# EAGLE design humidity_brick (EAGLE 7.2.0)
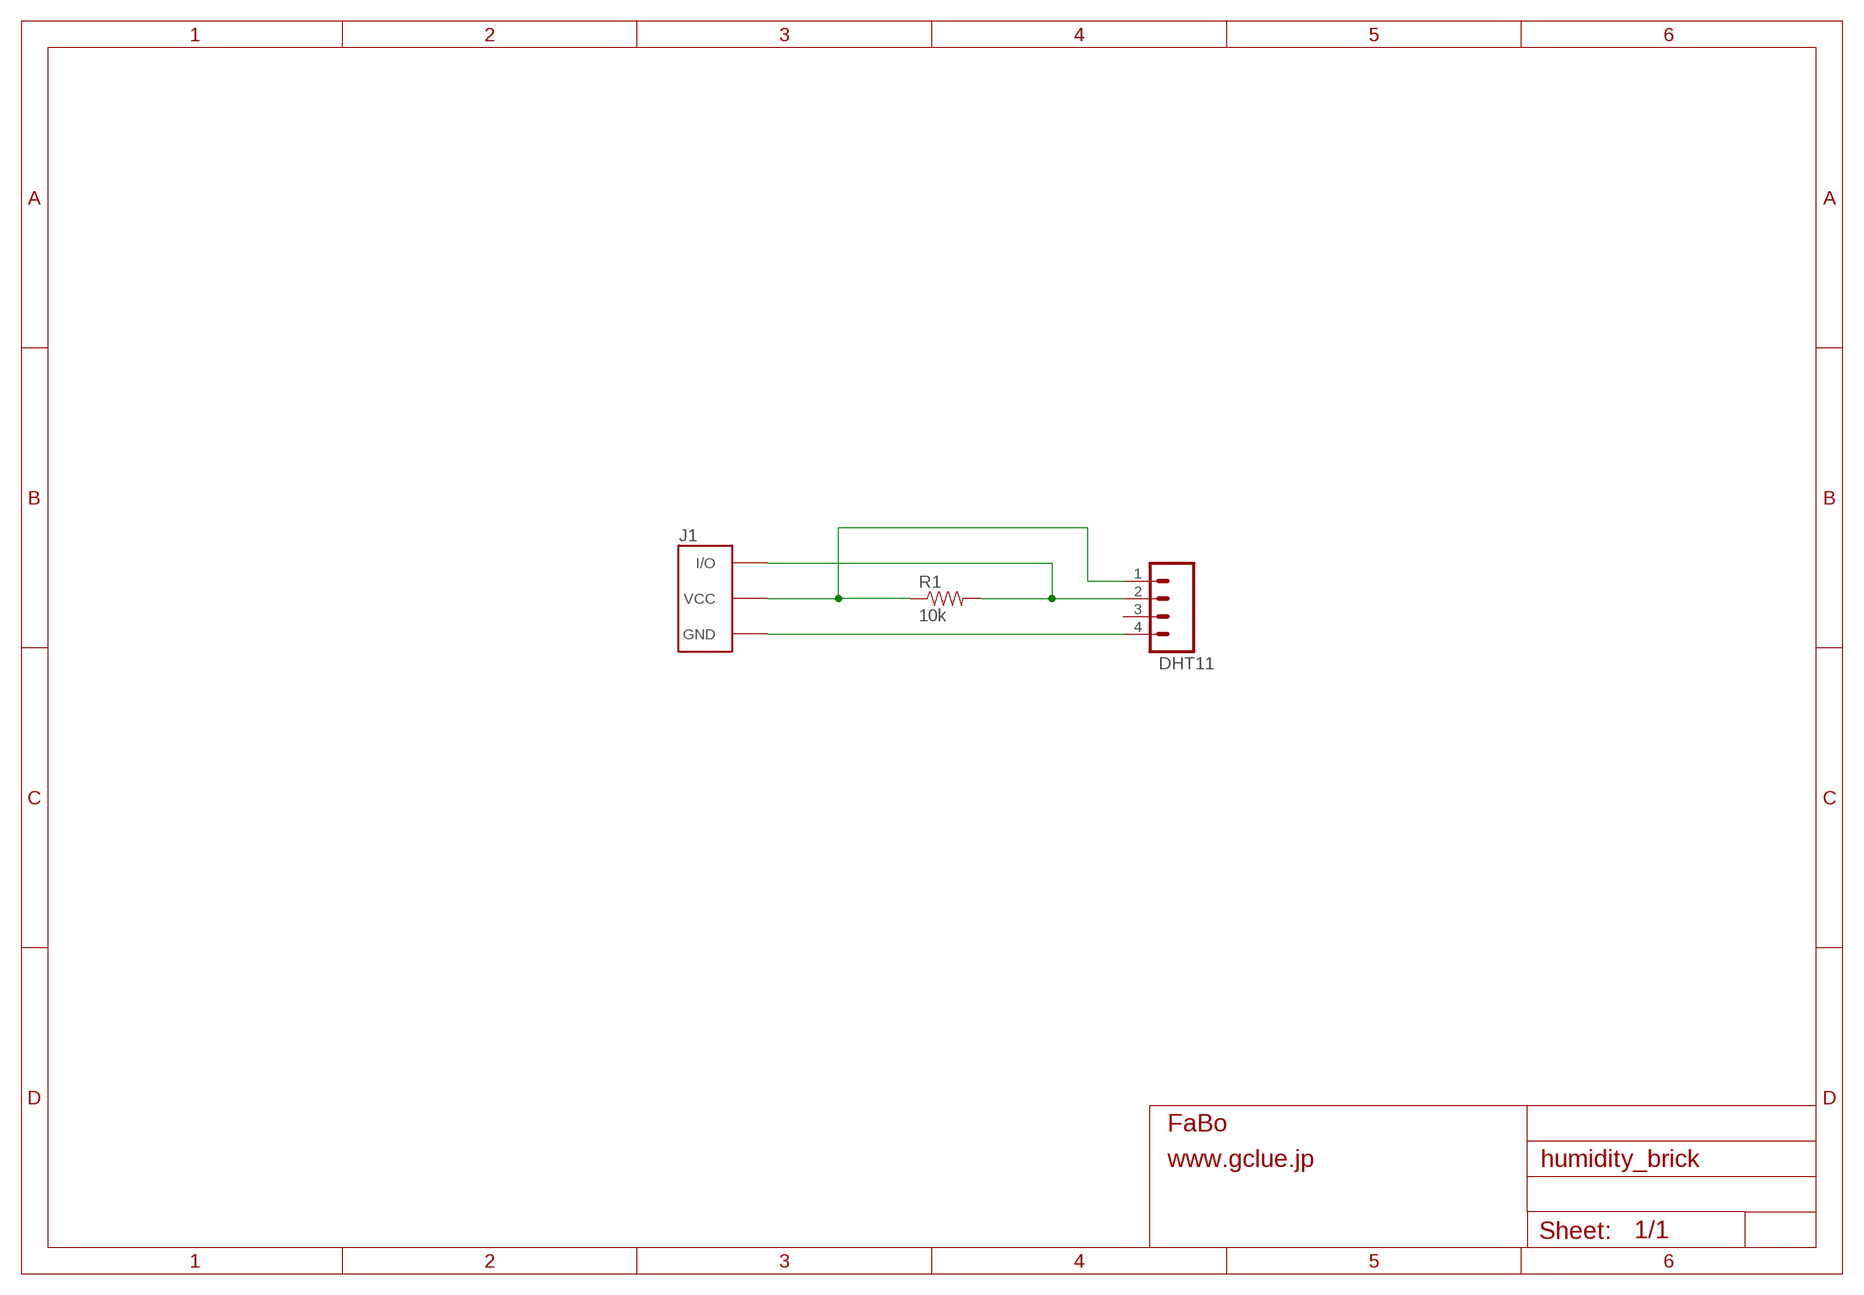
[diagram p0: schematic, sheet 1]

## Parts
J1  BRICK_3PIN  [BRICK_3PIN]
JP1  DHT11  M04LONGPADS  [1X04_LONGPADS]
R1  10k  RESISTORPTH-1/4W  [AXIAL-0.4]

## Nets
GND: J1.GND JP1.4
N$3: J1.IN/OUT(I/O) JP1.2 R1.P$2
N$5: J1.VCC JP1.1 R1.P$1
Unconnected: JP1.3

## Library data of the parts
J1 = gclue:BRICK_3PIN: FaBo Brick 3pin
JP1 = SparkFun-Connectors:M04: Header 4 Standard 4-pin 0.1" header. Use with straight break away headers (SKU : PRT-00116), right angle break away headers (PRT-00553), swiss pins (PRT-00743), machine pins (PRT-00117), and female headers (PRT-00115). Molex polarized connector foot print use with SKU : PRT-08231 with associated crimp pins and housings. 1MM SMD Version SKU: PRT-10208
R1 = SparkFun-Resistors:RESISTOR: Resistor Basic schematic elements and footprints for 0603, 1206, and PTH resistors.

## Board
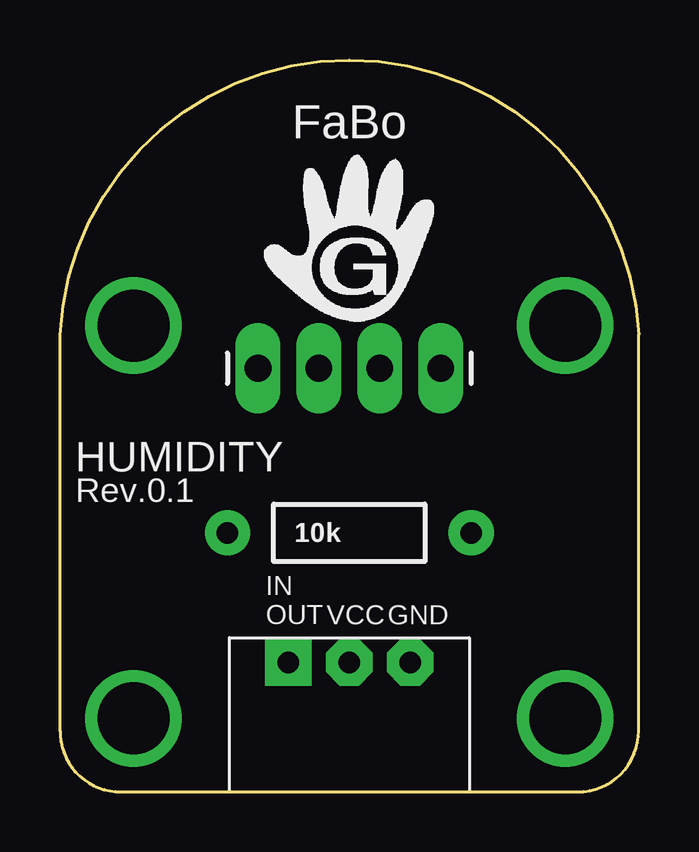
[diagram p1: board, top side]
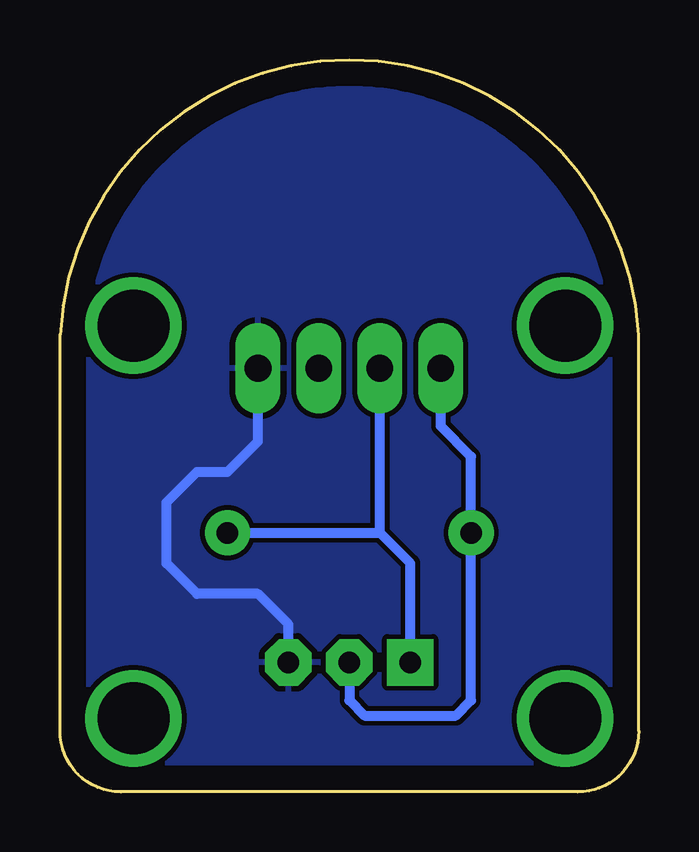
[diagram p2: board, bottom side, seen from below]

Size 24.13 x 30.5 mm. Coordinates in mm from the lower left corner, seen from the top.
Copper layers (1*16): Top 0.035mm / dielectric 1.5mm / Bottom 0.035mm
Design rules "default": minimum track width 10mil, minimum drill 24mil, track to track 8mil, track to pad 8mil, pad to pad 8mil, via to via 8mil, smd to smd 8mil, copper to edge 40mil, drill to drill 8mil, minimum pad ring 10mil, minimum via ring 8mil, stop-mask expansion 4mil, vias tented up to drill 0mil, thermal gap 10mil

### Footprints (pad centres in the part's own frame; a part is rotated, then mirrored left to right if it is on the bottom)
BRICK_3PIN = drill 0.9 pad 1.93 octagon: GND 2.54,-8.572; VCC 0,-8.572 | drill 0.9 pad 1.93 square: IN/OUT -2.54,-8.572 | drill 3 pad 3.81: P$1 -9,5.46; P$2 9,5.46; P$3 9,-10.905; P$4 -9,-10.905
1X04_LONGPADS = drill 1.118 pad 1.88 long: 1 0,0; 2 2.54,0; 3 5.08,0; 4 7.62,0
AXIAL-0.4 = drill 0.9 pad 1.88: P$1 -5.08,0; P$2 5.08,0

### Placement (x,y rotation side)
J1  12.06,13.97 0 top
JP1  8.26,17.65 0 top
R1  12.06,10.79 0 top

### Tracks (layer width: path | path; a pad name or v marks a point on that pad's centre or on a via)
GND
  Bottom 0.406: J1.GND 14.61,6.99 15.88,8.26 18.41,8.26 19.69,9.53 19.69,12.06 18.41,13.34 17.15,13.34 15.88,14.61 JP1.4
  pour Bottom: -0.63,-0.63 24.77,-0.63 24.77,31.12 -0.63,31.12
N$3
  Bottom 0.406: J1.IN/OUT 9.53,9.53 10.79,10.79 | 10.79,10.79 JP1.2 | R1.P$2 10.79,10.79
N$5
  Bottom 0.406: J1.VCC 12.06,3.81 11.43,3.18 7.62,3.18 6.99,3.81 R1.P$1 6.99,13.97 8.26,15.24 JP1.1

### Text on the board
tPlace: HUMIDITY | Rev.0.1 | IN / OUT | VCC | GND